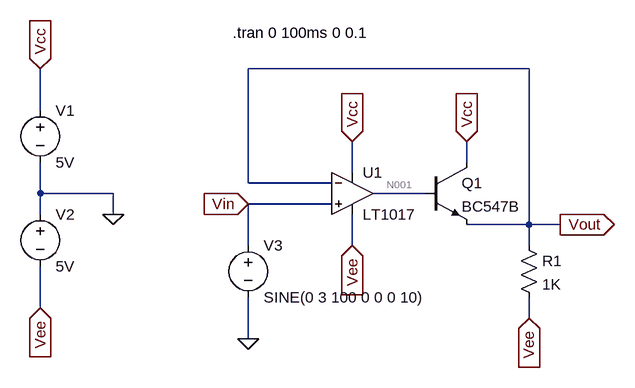
[diagram p0: schematic HCV_Follower.asc]
HCV_Follower.asc, the LTspice schematic file:
Version 4
SHEET 1 880 680
WIRE 464 -32 32 -32
WIRE -288 32 -288 -32
WIRE 368 112 368 80
WIRE 192 128 192 80
WIRE 32 144 32 -32
WIRE 160 144 32 144
WIRE -288 160 -288 112
WIRE -176 160 -288 160
WIRE 304 160 224 160
WIRE 160 176 32 176
WIRE -288 192 -288 160
WIRE -176 192 -176 160
WIRE 464 208 464 -32
WIRE 464 208 368 208
WIRE 512 208 464 208
WIRE 32 240 32 176
WIRE 192 240 192 192
WIRE 464 240 464 208
WIRE -288 336 -288 272
WIRE 464 352 464 320
WIRE 32 384 32 320
FLAG -176 192 0
FLAG -288 -32 Vcc
IOPIN -288 -32 In
FLAG -288 336 Vee
IOPIN -288 336 In
FLAG 192 80 Vcc
IOPIN 192 80 In
FLAG 192 240 Vee
IOPIN 192 240 In
FLAG 32 384 0
FLAG 512 208 Vout
IOPIN 512 208 Out
FLAG 32 176 Vin
IOPIN 32 176 In
FLAG 368 80 Vcc
IOPIN 368 80 In
FLAG 464 352 Vee
IOPIN 464 352 In
SYMBOL Comparators\\LT1017 192 160 R0
SYMATTR InstName U1
SYMBOL voltage -288 16 R0
SYMATTR InstName V1
SYMATTR Value 5V
SYMBOL voltage -288 176 R0
SYMATTR InstName V2
SYMATTR Value 5V
SYMBOL voltage 32 224 R0
SYMATTR InstName V3
SYMATTR Value SINE(0 3 100 0 0 0 10)
SYMBOL npn 304 112 R0
SYMATTR InstName Q1
SYMATTR Value BC547B
SYMBOL res 448 224 R0
SYMATTR InstName R1
SYMATTR Value 1K
TEXT 8 -88 Left 2 !.tran 0 100ms 0 0.1

The netlist it stands for:
* HCV_Follower.asc
XU1 Vin Vout Vcc Vee N001 LT1017  ; pins In+ In- V+ V- OUT
V1 Vcc 0 5V
V2 0 Vee 5V
V3 Vin 0 SINE(0 3 100 0 0 0 10)
Q1 Vcc N001 Vout 0 BC547B
R1 Vout Vee 1K
.model NPN NPN
.model PNP PNP
.lib standard.bjt
.tran 0 100ms 0 0.1
.backanno
.end

* Results of the author's LTspice run, read from the files saved beside the schematic
* Operating Point, zero values left out:
*   V(vcc) = 5 V
*   V(n001) = 681.7 mV
*   V(vee) = -5 V
*   V(vout) = 6.344 µV
*   Ic(Q1) = 4.983 mA
*   Ib(Q1) = 16.91 µA
*   Ie(Q1) = -5 mA
*   I(R1) = 5 mA
*   I(V3) = -3.1 nA
*   I(V2) = -5.196 mA
*   I(V1) = -5.196 mA
*   Ix(u1:1) = 3.1 nA
*   Ix(u1:2) = 3.1 nA
*   Ix(u1:3) = 212.7 µA
*   Ix(u1:4) = -195.8 µA
*   Ix(u1:5) = -16.91 µA
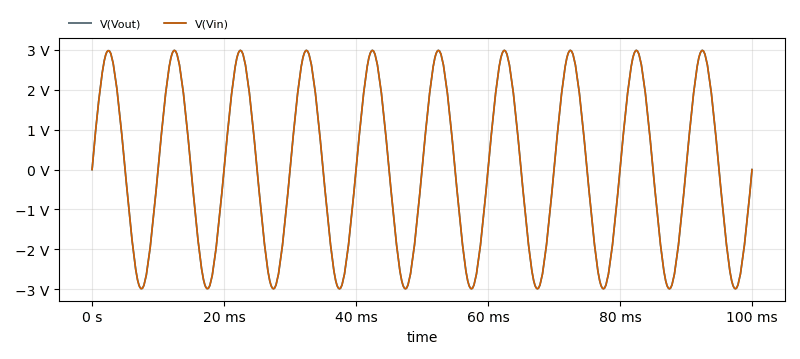
[diagram p1: Transient Analysis of HCV_Follower.asc, plotted from the saved traces]
* Transient Analysis, 1 run:
*   V(Vout): min -2.989 V, max 2.99 V, average 4.129 mV, rms 2.105 V, last 51.13 µV
*   V(Vin): min -2.989 V, max 2.99 V, average 4.122 mV, rms 2.105 V, last 0 V